# Altium schematic sheet bandit2.SchDoc
size A3
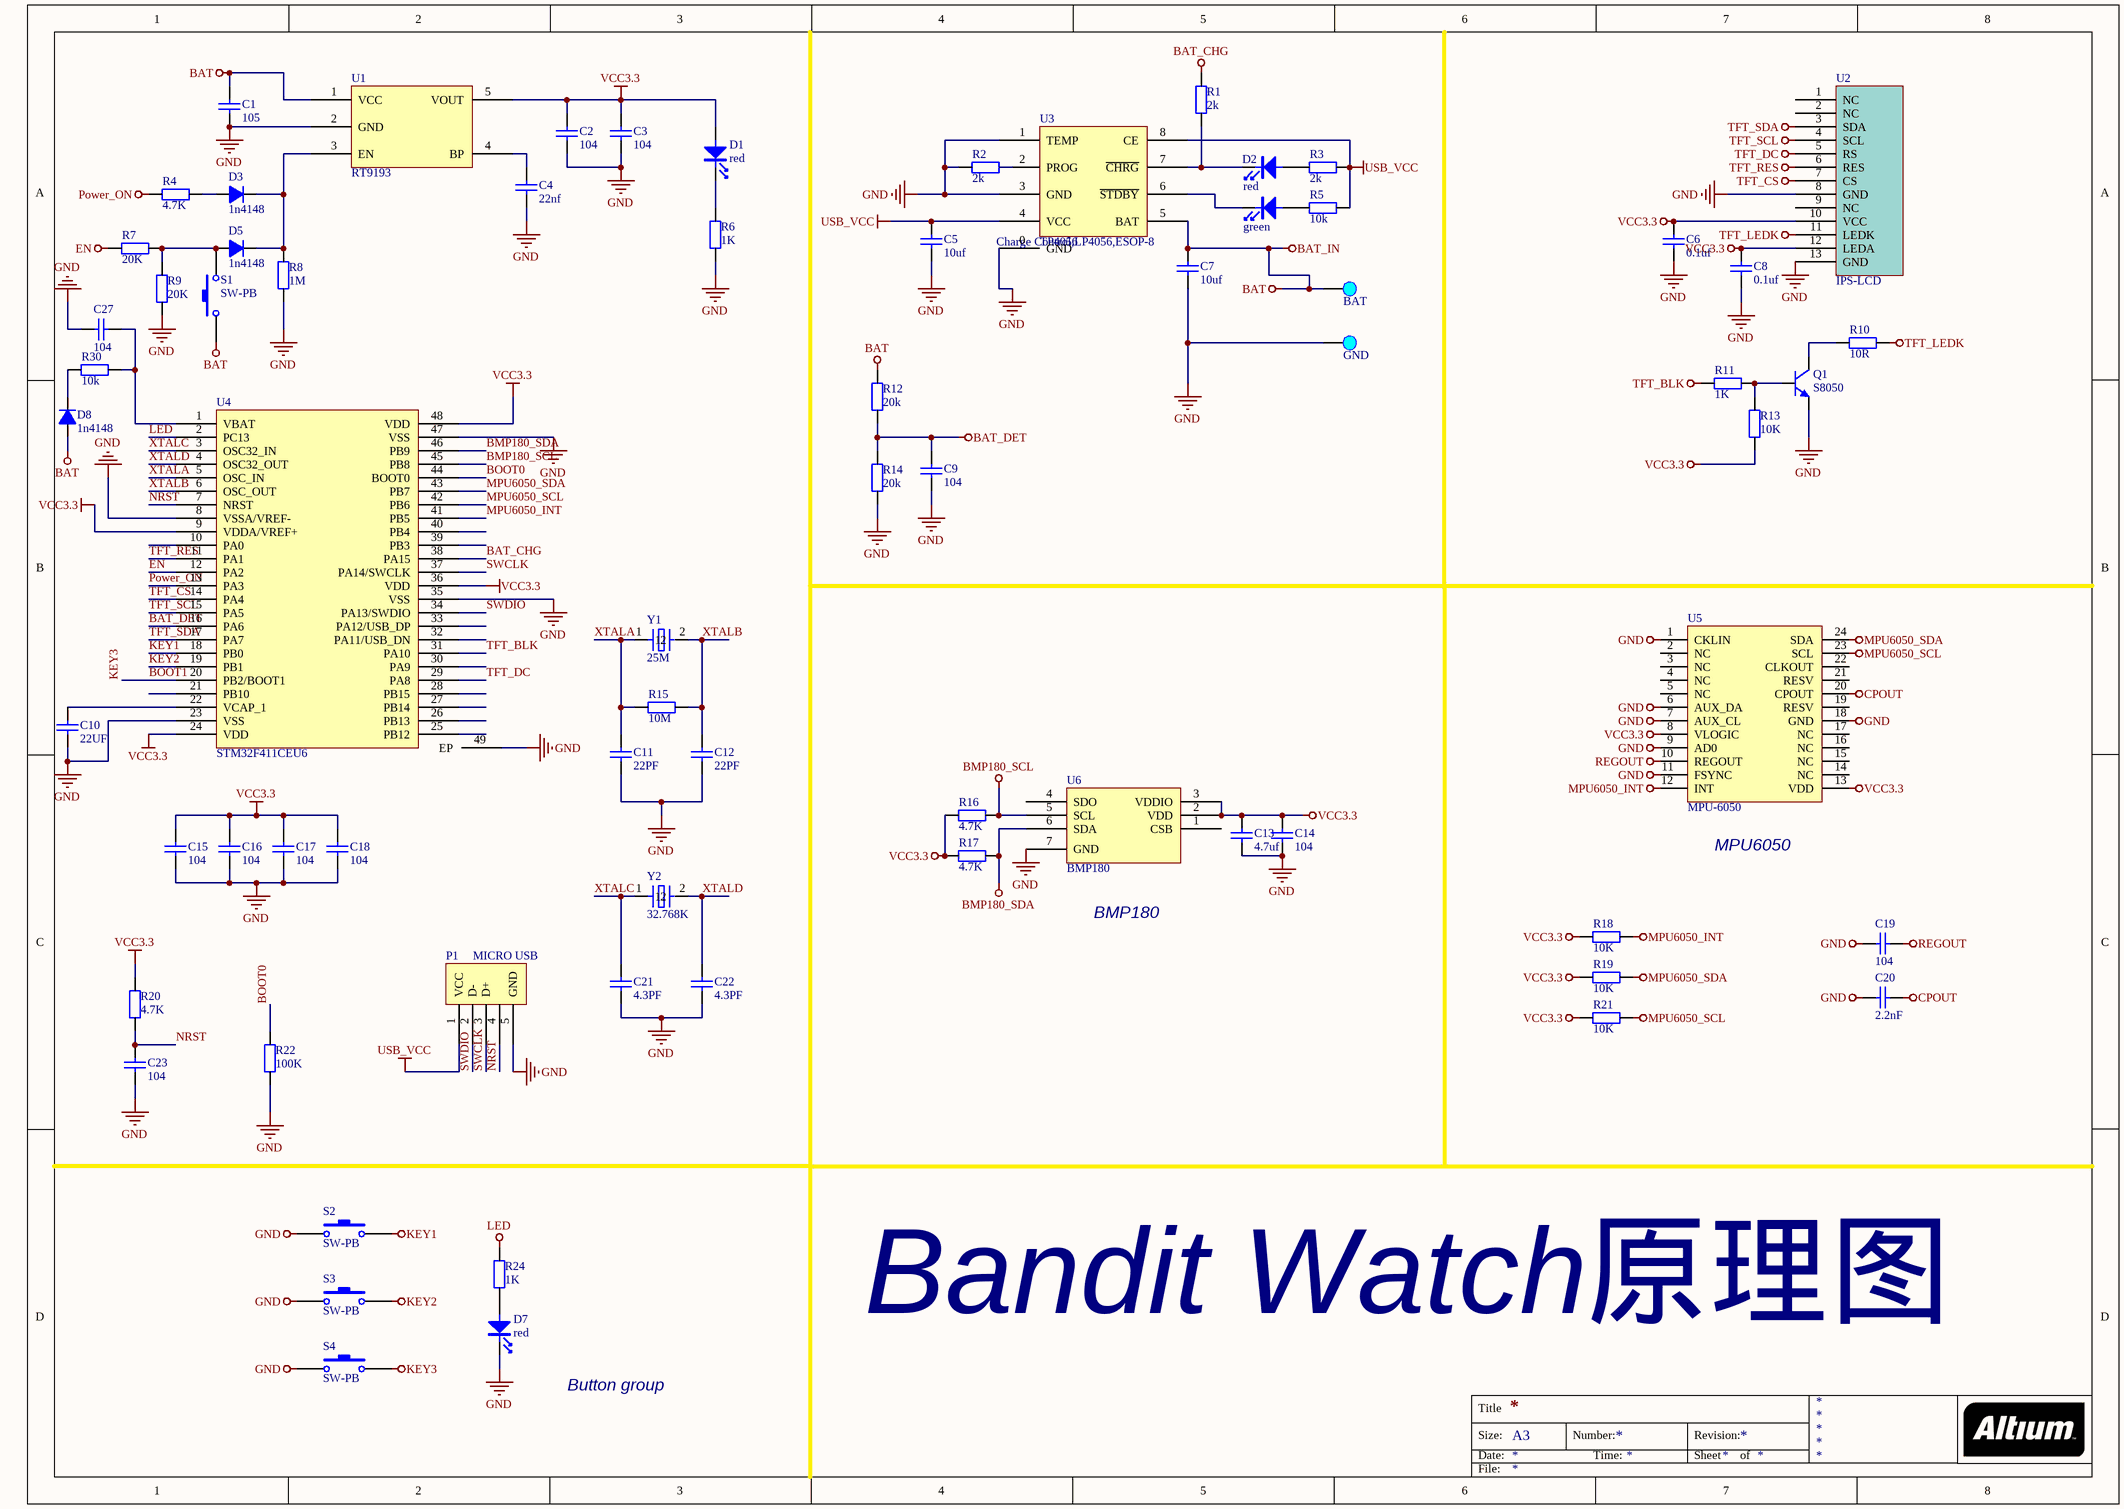
[diagram p0: bandit2.SchDoc]

## Parts
C1  105  [电容_C0603]
C2  104  [电容_C0603]
C3  104  [电容_C0603]
C4  22nf  [电容_C0603]
C5  10uf  [电容_C0603]
C6  0.1uf  [电容_C0603]
C7  10uf  [电容_C0603]
C8  0.1uf  [电容_C0603]
C9  104  [电容_C0603]
C10  22UF  [电容_C0603]
C11  22PF  [电容_C0603]
C12  22PF  [电容_C0603]
C13  4.7uf  [电容_C0603]
C14  104  [电容_C0603]
C15  104  [电容_C0603]
C16  104  [电容_C0603]
C17  104  [电容_C0603]
C18  104  [电容_C0603]
C19  104  [电容_C0603]
C20  2.2nF  [电容_C0603]
C21  4.3PF  [电容_C0603]
C22  4.3PF  [电容_C0603]
C23  104  [电容_C0603]
C27  104  [电容_C0603]
D1  red  [LED_0603]
D2  red  [LED_0603]
D3  1n4148  [LED_0603]
D4  green  [LED_0603]
D5  1n4148  [LED_0603]
D7  red  [LED_0603]
D8  1n4148  [LED_0603]
P1  MICRO USB  [接插件_MICRO 牛角插座 USB 卷边]
Pad1  BAT  [Pad_A]
Pad2  GND  [Pad_A]
Q1  S8050  [三极管_SOT-23]
R1  2k  [电阻_R0603]
R2  2k  [电阻_R0603]
R3  2k  [电阻_R0603]
R4  4.7K  [电阻_R0603]
R5  R: 10k  [电阻_R0603]  (hidden comment: 2k)
R6  1K  [电阻_R0603]
R7  20K  [电阻_R0603]
R8  1M  [电阻_R0603]
R9  20K  [电阻_R0603]
R10  10R  [电阻_R0603]
R11  1K  [电阻_R0603]
R12  20k  [电阻_R0603]
R13  10K  [电阻_R0603]
R14  20k  [电阻_R0603]
R15  R: 10M  [电阻_R0603]  (hidden comment: 2k)
R16  4.7K  [电阻_R0603]
R17  4.7K  [电阻_R0603]
R18  10K  [电阻_R0603]
R19  10K  [电阻_R0603]
R20  R: 4.7K  [电阻_R0603]  (hidden comment: 2k)
R21  10K  [电阻_R0603]
R22  R: 100K  [电阻_R0603]  (hidden comment: 2k)
R24  1K  [电阻_R0603]
R30  R: 10k  [电阻_R0603]  (hidden comment: 2k)
S1  SW-PB  [侧面按键3*6*3.5]
S2  SW-PB  [侧面按键3*6*3.5]
S3  SW-PB  [侧面按键3*6*3.5]
S4  SW-PB  [侧面按键3*6*3.5]
U1  RT9193  [SOT-23-5_L3.0-W1.7-P0.95-LS2.8-BR]
U2  IPS-LCD  [1.14IPS-LCD]
U3  TP4056  参数: Charge Control,LP4056,ESOP-8  [SOP-8_PAD]
U4  STM32F411CEU6  [STM-UFQFPN48_N]
U5  MPU-6050  [陀螺仪_QFN24]
U6  BMP180  [LGA-7]
Y1  25M  [OSC-SMD_4P-L3.2-W2.5-BL]
Y2  32.768K  [晶振_3215]

## Nets
BAT: C1.1 C7.2 D8.A Pad1.1 R12.2 S1.1 U1.1(VCC) U3.5(BAT)  [also labelled BAT_IN]
BAT_CHG: R1.2 U4.38(PA15)
BAT_DET: C9.2 R12.1 R14.2 U4.16(PA6)
BMP180_SCL: R16.1 U4.45(PB8) U6.5(SCL)
BMP180_SDA: R17.1 U4.46(PB9) U6.6(SDA)
BOOT1: S4.2 U4.20(PB2/BOOT1)  [also labelled KEY3]
CPOUT: C20.2 U5.20(CPOUT)
EN: R7.2 U4.12(PA2)
GND: C1.2 C2.2 C3.2 C4.2 C5.1 C6.1 C7.1 C8.1 C9.1 C10.2 C11.2 C12.2 C13.1 C14.1 C15.2 C16.2 C17.2 C18.2 C19.1 C20.1 C21.2 C22.2 C23.2 C27.2 D7.K P1.0 P1.5(GND) Pad2.1 Q1.3(E) R2.1 R6.1 R8.1 R9.2 R14.1 R22.1 S2.1 S3.1 S4.1 U1.2(GND) U2.8(GND) U2.13(GND) U3.0(GND) U3.1(TEMP) U3.3(GND) U4.8(VSSA/VREF-) U4.23(VSS) U4.35(VSS) U4.47(VSS) U4.49(EP) U5.0 U5.1(CKLIN) U5.6(AUX_DA) U5.7(AUX_CL) U5.9(AD0) U5.11(FSYNC) U5.18(GND) U6.7(GND)
KEY1: S2.2 U4.18(PB0)
KEY2: S3.2 U4.19(PB1)
LED: R24.1 U4.2(PC13)
MPU6050_INT: R18.1 U4.41(PB5) U5.12(INT)
MPU6050_SCL: R21.1 U4.42(PB6) U5.23(SCL)
MPU6050_SDA: R19.1 U4.43(PB7) U5.24(SDA)
Power_ON: R4.2 U4.13(PA3)
REGOUT: C19.2 U5.10(REGOUT)
TFT_BLK: R11.1 U4.31(PA10)
TFT_CS: U2.7(CS) U4.14(PA4)
TFT_DC: U2.5(RS) U4.29(PA8)
TFT_LEDK: R10.2 U2.11(LEDK)
TFT_RES: U2.6(RES) U4.11(PA1)
TFT_SCL: U2.4(SCL) U4.15(PA5)
TFT_SDA: U2.3(SDA) U4.17(PA7)
USB_VCC: C5.2 P1.1(VCC) R3.2 R5.2 U3.4(VCC) U3.8(CE)
VCC3.3: C2.1 C3.1 C6.2 C8.2 C13.2 C14.2 C15.1 C16.1 C17.1 C18.1 D1.A R13.1 R16.2 R17.2 R18.2 R19.2 R20.2 R21.2 U1.5(VOUT) U2.10(VCC) U2.12(LEDA) U4.9(VDDA/VREF+) U4.24(VDD) U4.36(VDD) U4.48(VDD) U5.8(VLOGIC) U5.13(VDD) U6.2(VDD) U6.3(VDDIO)
BOOT0: R22.2 U4.44(BOOT0)
NRST: C23.1 P1.4 R20.1 U4.7(NRST)
SWCLK: P1.3(D+) U4.37(PA14/SWCLK)
SWDIO: P1.2(D-) U4.34(PA13/SWDIO)
XTALA: C11.1 R15.1 U4.5(OSC_IN) Y1.1
XTALB: C12.1 R15.2 U4.6(OSC_OUT) Y1.2
XTALC: C21.1 U4.3(OSC32_IN) Y2.1
XTALD: C22.1 U4.4(OSC32_OUT) Y2.2
NetC4_1: C4.1 U1.4(BP)
NetC10_1: C10.1 U4.22(VCAP_1)
NetC27_1: C27.1 R30.2 U4.1(VBAT)
NetD1_K: D1.K R6.2
NetD2_A: D2.A R3.1
NetD2_K: D2.K R1.1 U3.7(~{CHRG})
NetD3_A: D3.A R4.1
NetD3_K: D3.K D5.K R8.2 U1.3(EN)
NetD4_A: D4.A R5.1
NetD4_K: D4.K U3.6(~{STDBY})
NetD5_A: D5.A R7.1 R9.1 S1.2
NetD7_A: D7.A R24.2
NetD8_K: D8.K R30.1
NetQ1_1: Q1.1(B) R11.2 R13.2
NetQ1_2: Q1.2(C) R10.1
NetR2_2: R2.2 U3.2(PROG)

Not connected (* = marked no-connect by the designer): U2 1(NC) 2(NC) 9(NC); U4 10(PA0) 21(PB10) 25(PB12) 26(PB13) 27(PB14) 28(PB15) 30(PA9) 32(PA11/USB_DN) 33(PA12/USB_DP) 39(PB3) 40(PB4); U5 2(NC) 3(NC) 4(NC) 5(NC) 14(NC) 15(NC) 16(NC) 17(NC) 19(RESV) 21(RESV) 22(CLKOUT); U6 1(CSB) 4(SDO)

## Notes on the sheet
- (near U5) MPU6050
- BMP180
- Button group
- Bandit Watch原理图
- Title
- Size:
- Date:
- A3
- Number:
- Time:
- Revision:
- Sheet
- of
- File:

## Library data of the parts
C1-C23 C27 = cap: U: 50V; 参数: Cap,0805,X7R,104K,50V,125C,±10%
  C1: C: 105
  C2 C3 C9 C14-C19 C23 C27: C: 104
  C4: C: 22nf
  C5 C7: C: 10uf
  C6 C8: C: 0.1uf
  C10: C: 22UF
  C11 C12: C: 22PF
  C13: C: 4.7uf
  C20: C: 2.2nF
  C21 C22: C: 4.3PF
D1 D2 D4 D7 = LED: 参数: LED,0603,Red
D3 D5 D8 = Diode: Default Diode; Published: 8-Jun-2000; LatestRevisionDate: 17-Jul-2002; LatestRevisionNote: Re-released for DXP Platform.; PackageVersion: Sep-1996; PackageReference: SMC; Publisher: Altium Limited; PackageDescription: DO-214-AB/SMC; 2 C-Bend Leads; Body 7.9 x 5.9 mm, inc. leads (LxW); Code_JEDEC: DO-214-AB
P1 = MICRO USB 5PIN: _Comma: ,; _Name: Port; _Specification: Port,MICRO USB,5PIN; _Value: 5PIN; _Model: MICRO USB
Pad1 = Pad: _Funcyusa: Test; _Specification: Pad,Test,BAT; _Comma: ,; _Name: Pad; _Remarks: BAT
Pad2 = Pad: _Funcyusa: Test; _Specification: Pad,Test,GND; _Comma: ,; Rule: PcbType=ProtelPcb; _Name: Pad; _Remarks: GND
Q1 = Triode-NPN: _Comma: ,; _Current: 500mA; _Footprint: SOT-23; _Name: Triode; _Specification: Triode,NPN,S8050,SOT-23,500mA,40V; _Voltage: 40V; _Polarity: NPN; _Model: S8050
R1-R9 R12 R14-R22 R24 R30 = Res: P: 1/8W; 参数: Res,0805,0R,±1%,1/8W,100ppm,155C
  R1-R3: R: 2k
  R4 R16 R17: R: 4.7K
  R6 R24: R: 1K
  R7 R9: R: 20K
  R8: R: 1M
  R12 R14: R: 20k
  R18 R19 R21: R: 10K
R10 = Res: _Accuracy: 1%; _Power: 1/8W; _Footprint: 0805; _Drift: 100ppm; _Comma: ,; _Specification: Res,0805,10R,1%,1/8W,100ppm; _Name: Res; _Value: 10R
R11 = Res: _Accuracy: 1%; _Power: 1/8W; _Footprint: 0805; _Drift: 100ppm; _Comma: ,; _Specification: Res,0805,1K,1%,1/8W,100ppm; _Name: Res; _Value: 1K
R13 = Res: _Accuracy: 1%; _Power: 1/8W; _Footprint: 0805; _Drift: 100ppm; _Comma: ,; _Specification: Res,0805,10K,1%,1/8W,100ppm; _Name: Res; _Value: 10K
S1-S4 = SW-PB: 按键
U2 = IPS-LCD-1.14: IPS-LCD-1.14寸裸屏spi接口
U4 = Component_1
U6 = BMP180: 数字气压传感器
Y1 = XTAL_A: pin to pad: 2>3; _Name: CRYSTALS; _Comma: ,; _Specification: CRYSTALS,25M,*,10ppm,12pF; _Accuracy: 10ppm; _CL: 12pF; _Footprint: *; _Frequency: 25M
Y2 = XTAL_A: _Name: CRYSTALS; _Comma: ,; _Specification: CRYSTALS,32.768K,*,10ppm,12pF; _Accuracy: 10ppm; _CL: 12pF; _Footprint: *; _Frequency: 32.768K